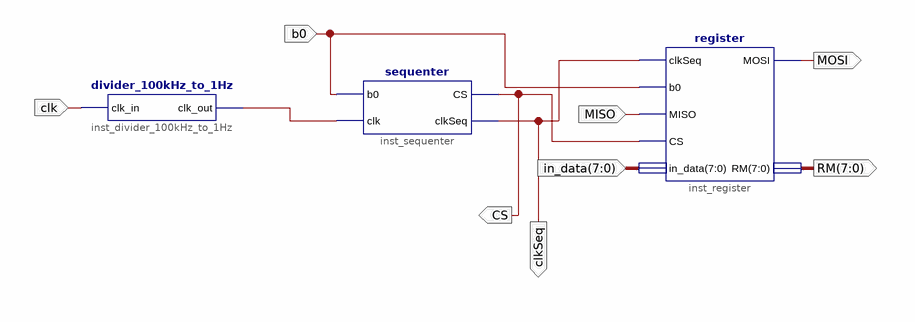
[diagram p0: schematic sheet 1]
// Xilinx ISE schematic schematic.sch (xbr) as structural Verilog: 3 symbols, 8 ports
module schematic (
  input  clk,
  input  b0,
  input  MISO,
  input  [7:0] in_data,
  output MOSI,
  output [7:0] RM,
  output clkSeq,
  output CS
);

  wire XLXN_7;

  divider_100kHz_to_1Hz inst_divider_100kHz_to_1Hz (.clk_in(clk), .clk_out(XLXN_7));
  sequenter inst_sequenter (.b0(b0), .clk(XLXN_7), .CS(CS), .clkSeq(clkSeq));
  register inst_register (.clkSeq(clkSeq), .b0(b0), .MISO(MISO), .CS(CS), .in_data(in_data), .MOSI(MOSI), .RM(RM));
endmodule
